# Altium schematic sheet ICwT_ft4232.SchDoc
size A4
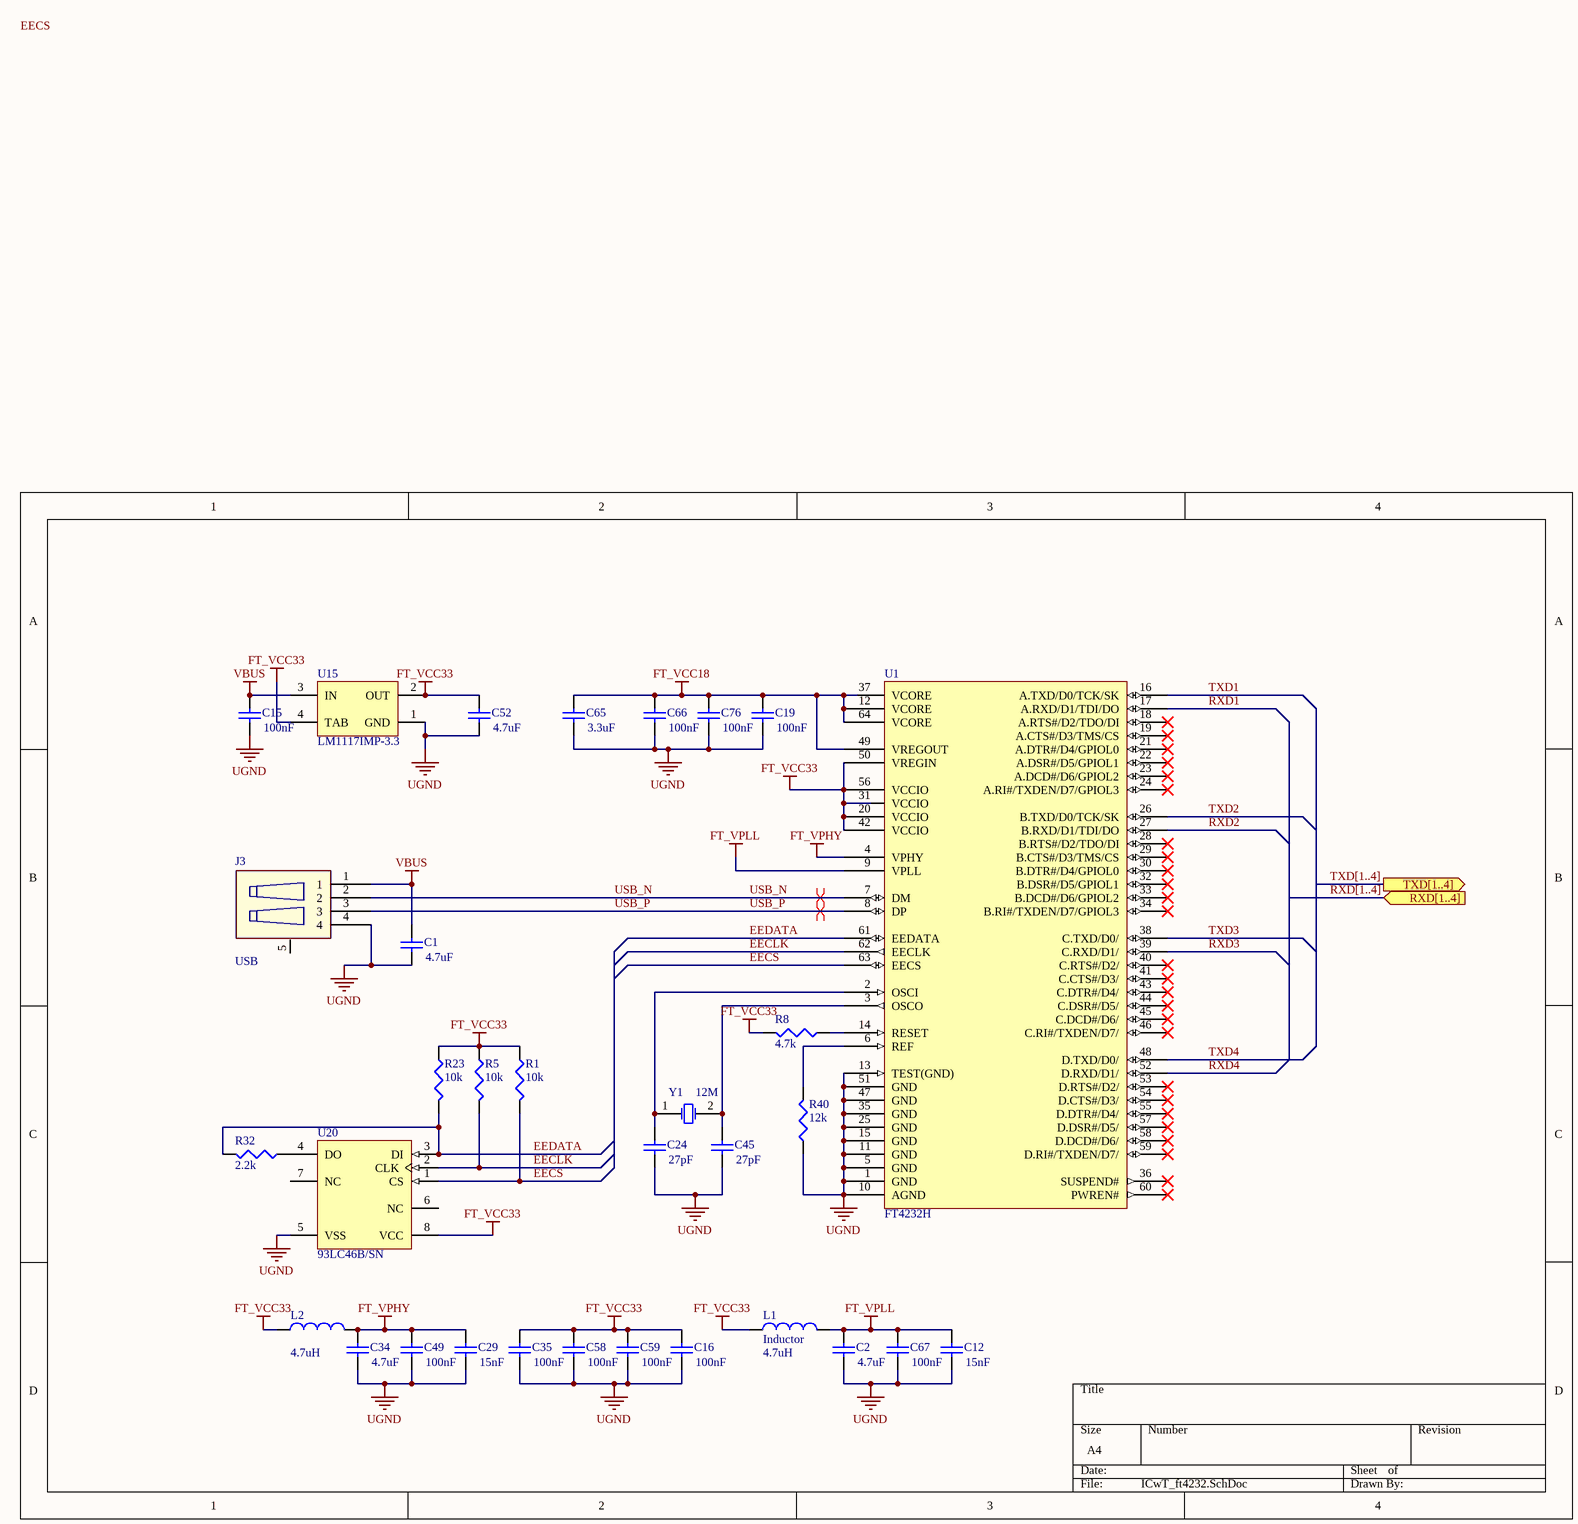
[diagram p0: ICwT_ft4232.SchDoc]

## Parts
C1  value 4.7uF  [C_0603]  (hidden comment: Cap)
C2  value 4.7uF  [C_0603]  (hidden comment: Cap)
C12  value 15nF  [C_0603]  (hidden comment: Cap)
C15  value 100nF  [C_0603]  (hidden comment: Cap)
C16  value 100nF  [C_0603]  (hidden comment: Cap)
C19  value 100nF  [C_0603]  (hidden comment: Cap)
C24  value 27pF  [C_0603]  (hidden comment: Cap)
C29  value 15nF  [C_0603]  (hidden comment: Cap)
C34  value 4.7uF  [C_0603]  (hidden comment: Cap)
C35  value 100nF  [C_0603]  (hidden comment: Cap)
C45  value 27pF  [C_0603]  (hidden comment: Cap)
C49  value 100nF  [C_0603]  (hidden comment: Cap)
C52  value 4.7uF  [C_0603]  (hidden comment: Cap)
C58  value 100nF  [C_0603]  (hidden comment: Cap)
C59  value 100nF  [C_0603]  (hidden comment: Cap)
C65  value 3.3uF  [C_0603]  (hidden comment: Cap)
C66  value 100nF  [C_0603]  (hidden comment: Cap)
C67  value 100nF  [C_0603]  (hidden comment: Cap)
C76  value 100nF  [C_0603]  (hidden comment: Cap)
J3  USB  [USBB]
L1  Inductor  value 4.7uH  [L_0805]
L2  value 4.7uH  [L_0805]  (hidden comment: Inductor)
R1  value 10k  [R_0603]  (hidden comment: Res)
R5  value 10k  [R_0603]  (hidden comment: Res)
R8  value 4.7k  [R_0603]  (hidden comment: Res)
R23  value 10k  [R_0603]  (hidden comment: Res)
R32  value 2.2k  [R_0603]  (hidden comment: Res)
R40  value 12k  [R_0603]  (hidden comment: Res)
U1  FT4232H  [LQFP64_M]
U15  LM1117IMP-3.3  [MP04A_L]
U20  93LC46B/SN  [SOIC-SN8_N]
Y1  value 12M  [QUARTZ_0532_MJ]  (hidden comment: SMD XTAL)

## Ports
RXD[1..4] (in), TXD[1..4] (out)

## Nets
FT_VCC18: C19.2 C65.2 C66.2 C76.2 U1.12(VCORE) U1.37(VCORE) U1.49(VREGOUT) U1.64(VCORE)
FT_VCC33: C16.2 C35.2 C52.2 C58.2 C59.2 L1.1 L2.1 R1.1 R5.1 R8.2 R23.1 U1.20(VCCIO) U1.31(VCCIO) U1.42(VCCIO) U1.50(VREGIN) U1.56(VCCIO) U15.2(OUT) U15.4(TAB) U20.8(VCC)
FT_VPHY: C29.2 C34.2 C49.2 L2.2 U1.4(VPHY)
FT_VPLL: C2.2 C12.2 C67.2 L1.2 U1.9(VPLL)
UGND: C1.1 C2.1 C12.1 C15.1 C16.1 C19.1 C24.2 C29.1 C34.1 C35.1 C45.2 C49.1 C52.1 C58.1 C59.1 C65.1 C66.1 C67.1 C76.1 J3.4 R40.1 U1.1(GND) U1.5(GND) U1.10(AGND) U1.11(GND) U1.13(TEST(GND)) U1.15(GND) U1.25(GND) U1.35(GND) U1.47(GND) U1.51(GND) U15.1(GND) U20.5(VSS)
VBUS: C1.2 C15.2 J3.1 U15.3(IN)
EECLK: R5.2 U1.62(EECLK) U20.2(CLK)
EECS: R1.2 U1.63(EECS) U20.1(CS)
EEDATA: R23.2 R32.2 U1.61(EEDATA) U20.3(DI)
RXD1: U1.17(A.RXD/D1/TDI/DO)
RXD2: U1.27(B.RXD/D1/TDI/DO)
RXD3: U1.39(C.RXD/D1/)
RXD4: U1.52(D.RXD/D1/)
TXD1: U1.16(A.TXD/D0/TCK/SK)
TXD2: U1.26(B.TXD/D0/TCK/SK)
TXD3: U1.38(C.TXD/D0/)
TXD4: U1.48(D.TXD/D0/)
USB_N: J3.2 U1.7(DM)
USB_P: J3.3 U1.8(DP)
NetC24_1: C24.1 U1.2(OSCI) Y1.1(OSC1)
NetC45_1: C45.1 U1.3(OSCO) Y1.2(OSC2)
NetR8_1: R8.1 U1.14(RESET)
NetR32_1: R32.1 U20.4(DO)
NetR40_2: R40.2 U1.6(REF)

Not connected (* = marked no-connect by the designer): J3 5; U1 18(A.RTS#/D2/TDO/DI)* 19(A.CTS#/D3/TMS/CS)* 21(A.DTR#/D4/GPIOL0)* 22(A.DSR#/D5/GPIOL1)* 23(A.DCD#/D6/GPIOL2)* 24(A.RI#/TXDEN/D7/GPIOL3)* 28(B.RTS#/D2/TDO/DI)* 29(B.CTS#/D3/TMS/CS)* 30(B.DTR#/D4/GPIOL0)* 32(B.DSR#/D5/GPIOL1)* 33(B.DCD#/D6/GPIOL2)* 34(B.RI#/TXDEN/D7/GPIOL3)* 36(SUSPEND#)* 40(C.RTS#/D2/)* 41(C.CTS#/D3/)* 43(C.DTR#/D4/)* 44(C.DSR#/D5/)* 45(C.DCD#/D6/)* 46(C.RI#/TXDEN/D7/)* 53(D.RTS#/D2/)* 54(D.CTS#/D3/)* 55(D.DTR#/D4/)* 57(D.DSR#/D5/)* 58(D.DCD#/D6/)* 59(D.RI#/TXDEN/D7/)* 60(PWREN#)*; U20 6(NC) 7(NC)

## Buses and harness runs
bus RXD[1..4] = port RXD[1..4]
bus TXD[1..4] = port TXD[1..4]

## Layout directives
differential pair: USB_N, USB_P

## Notes on the sheet
- Labels drawn without touching a wire or pin: EECS

## Library data of the parts
C1 C2 C12 C15 C16 C19 C24 C29 C34 C35 C45 C49 C52 C58 C59 C65-C67 C76 = Cap: Capacitor; Published: 8-Jun-2000; LatestRevisionDate: 17-Jul-2002; LatestRevisionNote: Re-released for DXP Platform.; PackageReference: RAD-0.3; Publisher: Altium Limited; PackageDescription: Radial Cap, Thru-Hole; 2 Leads; 0.3 in Pin Spacing
J3 = USB: USB-B connector
L1 L2 = Inductor: Code_IEC: 1005; Published: 8-Jun-2000; LatestRevisionDate: 29-May-2009; LatestRevisionNote: IPC-7351 Footprint Added.; PackageReference: 0402-A; Publisher: Altium Limited; PackageDescription: Chip Inductor; Code_JEITA: 0402
R1 R5 R8 R23 R32 R40 = Res3: Resistor; Published: 8-Jun-2000; LatestRevisionDate: 29-May-2009; LatestRevisionNote: IPC-7351 Footprint Added.; PackageReference: J1-0603; Publisher: Altium Limited; PackageDescription: Chip Resistor
U1 = FT4232H: USR to RS232 transceiver
U15 = LM1117IMP-3.3: 800mA Low-Dropout Linear Regulator; Manufacturer: National Semiconductor; CompType: LDO IC; PackageTopMarking: XYTT*N05B; PowerWise: N; Published: 4-Dec-2008; DatasheetVersion: Apr-2006; PackageVersion: revB, Apr-2003; PackageReference: MP04A; Publisher: Altium Limited; PackageDescription: Molded SOT-223, 6.50 x 3.56 x 1.6mm Body, 4 Lead, 2.3mm Pitch; PartNumber: LM1117IMP-3.3; RoHS: O; PinCount: 4; DigiKeyPartNumber: LM1117IMP-3.3CT-ND; Code_JEDEC: TO-261-AA; Code_IPC: SOT223-4; ComponentLink1Description: LM1117 Datasheet; ComponentLink1URL: http://www.national.com/ds/LM/LM1117.pdf; ComponentLink2Description: LM1117 Web Page; ComponentLink2URL: http://www.national.com/pf/LM/LM1117.html; ComponentLink3Description: MP04A Package Page; ComponentLink3URL: http://www.national.com/packaging/folders/mp04a.html
U20 = 93LC46B/SN: 1K, 64x16-bit, 2.5V Microwire Serial EEPROM, 8-Pin SOIC 150mil, Commercial Temperature; FirstPublished: 29-Jan-2009; DatasheetVersion: revG, May-2008; PackageVersion: revBB, Aug-2009; PackageReference: SOIC-SN8; Publisher: Altium Limited; PackageDescription: 8-Lead Plastic Small Outline (SN) - Narrow, 3.90mm Body [SOIC]; Supplier 1: Digi-Key; Supplier Part Number 1: 93LC46B/SN-ND; Supplier 2: Farnell; Supplier Part Number 2: 9758224; Supplier 3: Newark; Supplier Part Number 3: 65K1153; Code_JEDEC: MS-012; Code_IPC: SOIC127P600-8; ComponentLink1Description: Datasheet; ComponentLink1URL: http://ww1.microchip.com/downloads/en/DeviceDoc/21749G.pdf; ComponentLink2Description: Packaging Specification; ComponentLink2URL: http://www.microchip.com/stellent/groups/techpub_sg/documents/packagingspec/en012702.pdf; ComponentLink3Description: Microchip.com Home; ComponentLink3URL: http://www.microchip.com/
Y1 = XTAL: 0532 12MHz XTAL; pin to pad: 1>2 2>4; Published: 8-Jun-2000; LatestRevisionDate: 17-Jul-2002; LatestRevisionNote: Re-released for DXP Platform.; PackageReference: R38; Publisher: Altium Limited; PackageDescription: Crystal, Thru-Hole; 2 Leads; Body 3.1 x 8.2 mm (Dia.xH)